# Altium schematic sheet motor.SchDoc
size A3
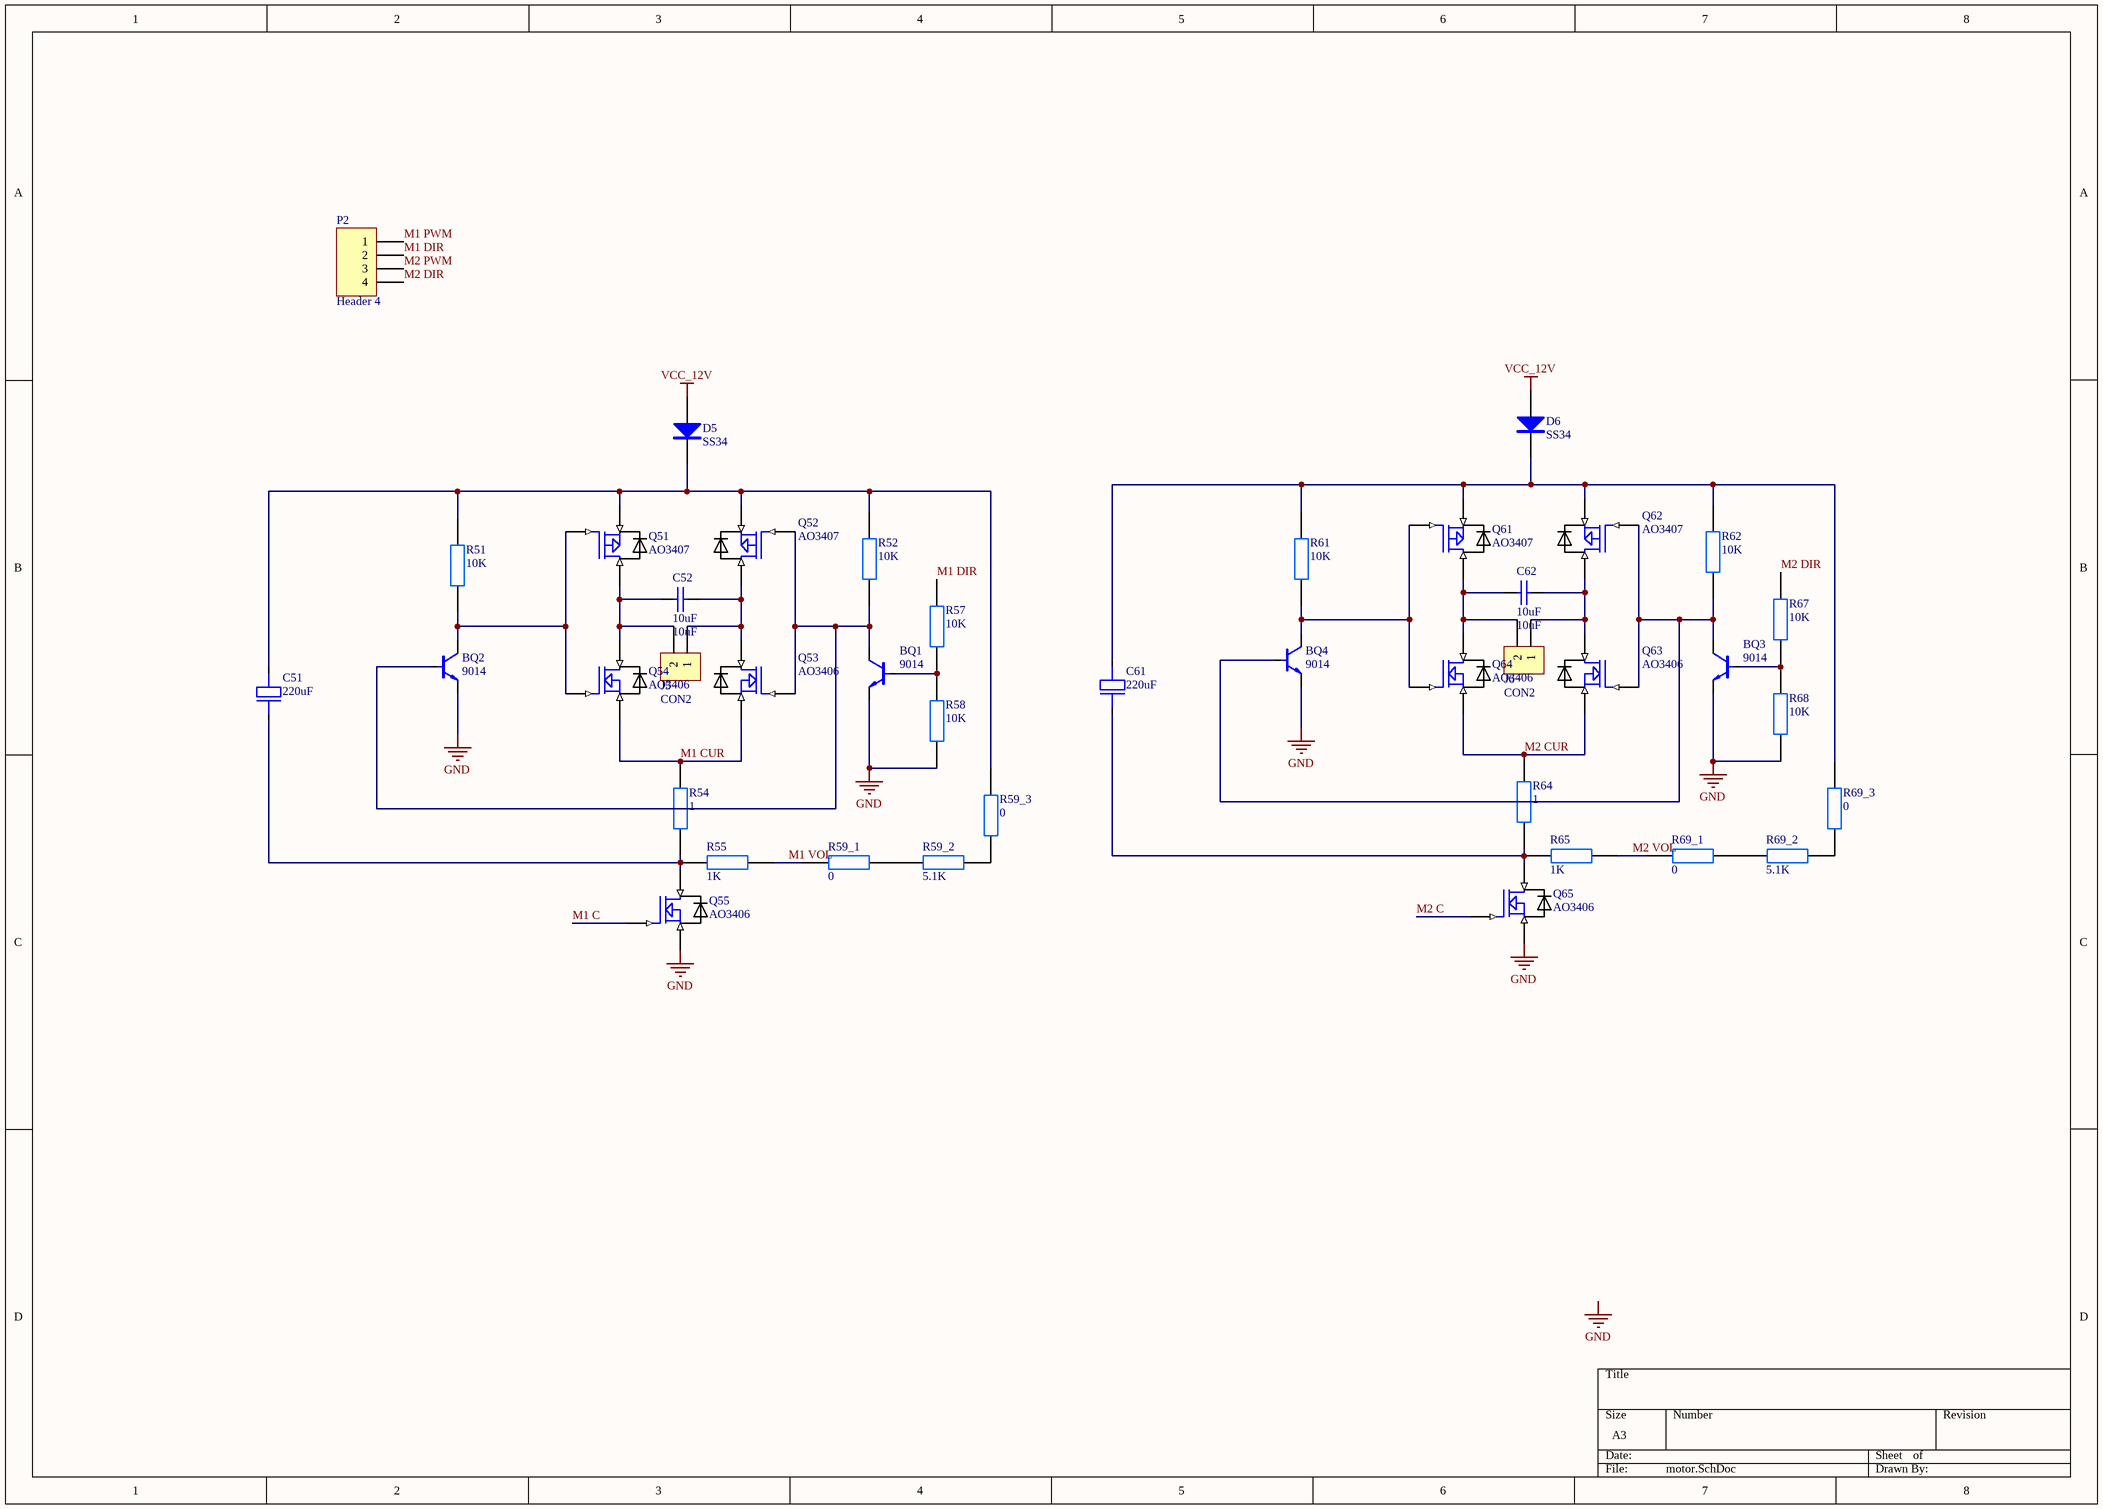
[diagram p0: motor.SchDoc]

## Parts
BQ1  9014  [SOT-23]
BQ2  9014  [SOT-23]
BQ3  9014  [SOT-23]
BQ4  9014  [SOT-23]
C51  220uF  [SMD-EC-F10]
C52  10uF  [0805 CAP]
C61  220uF  [SMD-EC-F10]
C62  10uF  [0805 CAP]
D5  SS34  [SMA]
D6  SS34  [SMA]
J5  CON2  [con2]
J6  CON2  [con2]
P2  Header 4  [HDR1X4]
Q51  AO3407  [sot-23]
Q52  AO3407  [sot-23]
Q53  AO3406  [sot-23]
Q54  AO3406  [sot-23]
Q55  AO3406  [sot-23]
Q61  AO3407  [sot-23]
Q62  AO3407  [sot-23]
Q63  AO3406  [sot-23]
Q64  AO3406  [sot-23]
Q65  AO3406  [sot-23]
R51  10K  [0805]
R52  10K  [0805]
R54  1  [2512]
R55  1K  [0805]
R57  10K  [0805]
R58  10K  [0805]
R59_1  0  [0805]
R59_2  5.1K  [0805]
R59_3  0  [0805]
R61  10K  [0805]
R62  10K  [0805]
R64  1  [2512]
R65  1K  [0805]
R67  10K  [0805]
R68  10K  [0805]
R69_1  0  [0805]
R69_2  5.1K  [0805]
R69_3  0  [0805]

## Nets
GND: BQ1.e BQ2.e BQ3.e BQ4.e Q55.3(S) Q65.3(S) R58.1 R68.1
VCC_12V: D5.1(A) D6.1(A)
M1 C: Q55.1(G)
M1 CUR: Q53.3(S) Q54.3(S) R54.2
M1 DIR: P2.2 R57.2
M1 PWM: P2.1
M1 VOL: R55.2 R59_1.2
M2 C: Q65.1(G)
M2 CUR: Q63.3(S) Q64.3(S) R64.2
M2 DIR: P2.4 R67.2
M2 PWM: P2.3
M2 VOL: R65.2 R69_1.2
NetBQ1_b: BQ1.b R57.1 R58.2
NetBQ1_c: BQ1.c BQ2.b Q52.1(G) Q53.1(G) R52.1
NetBQ2_c: BQ2.c Q51.1(G) Q54.1(G) R51.1
NetBQ3_b: BQ3.b R67.1 R68.2
NetBQ3_c: BQ3.c BQ4.b Q62.1(G) Q63.1(G) R62.1
NetBQ4_c: BQ4.c Q61.1(G) Q64.1(G) R61.1
NetC51_1: C51.1 D5.2(K) Q51.3(S) Q52.3(S) R51.2 R52.2 R59_3.2
NetC51_2: C51.2 Q55.2(D) R54.1 R55.1
NetC52_1: C52.1 J5.2 Q51.2(D) Q54.2(D)
NetC52_2: C52.2 J5.1 Q52.2(D) Q53.2(D)
NetC61_1: C61.1 D6.2(K) Q61.3(S) Q62.3(S) R61.2 R62.2 R69_3.2
NetC61_2: C61.2 Q65.2(D) R64.1 R65.1
NetC62_1: C62.1 J6.2 Q61.2(D) Q64.2(D)
NetC62_2: C62.2 J6.1 Q62.2(D) Q63.2(D)
NetR59_1_1: R59_1.1 R59_2.1
NetR59_2_2: R59_2.2 R59_3.1
NetR69_1_1: R69_1.1 R69_2.1
NetR69_2_2: R69_2.2 R69_3.1

## Notes on the sheet
- Labels drawn without touching a wire or pin: GND

## Library data of the parts
BQ1-BQ4 = 9014: transistor; pin to pad: b>1 c>3 e>2
C51 C61 = Electrolytic CAP: VALUE: 220uF
C52 C62 = CAP: VALUE: 10uF
D5 D6 = SS14: Diode
P2 = Header 4: Header, 4-Pin; LatestRevisionDate: 17-Jul-2002; LatestRevisionNote: Re-released for DXP Platform.; Publisher: Altium Limited
Q51 Q52 Q61 Q62 = AO3407: pin to pad: 2>3 3>2
Q53-Q55 Q63-Q65 = AO3406: pin to pad: 2>3 3>2
R51 R52 R54 R55 R57 R58 R59_1-R59_3 R61 R62 R64 R65 R67 R68 R69_1-R69_3 = RES
  R51 R52 R57 R58 R61 R62 R67 R68: VALUE: 10K
  R54 R64: VALUE: 1
  R55 R65: VALUE: 1K
  R59_1 R59_3 R69_1 R69_3: VALUE: 0
  R59_2 R69_2: VALUE: 5.1K